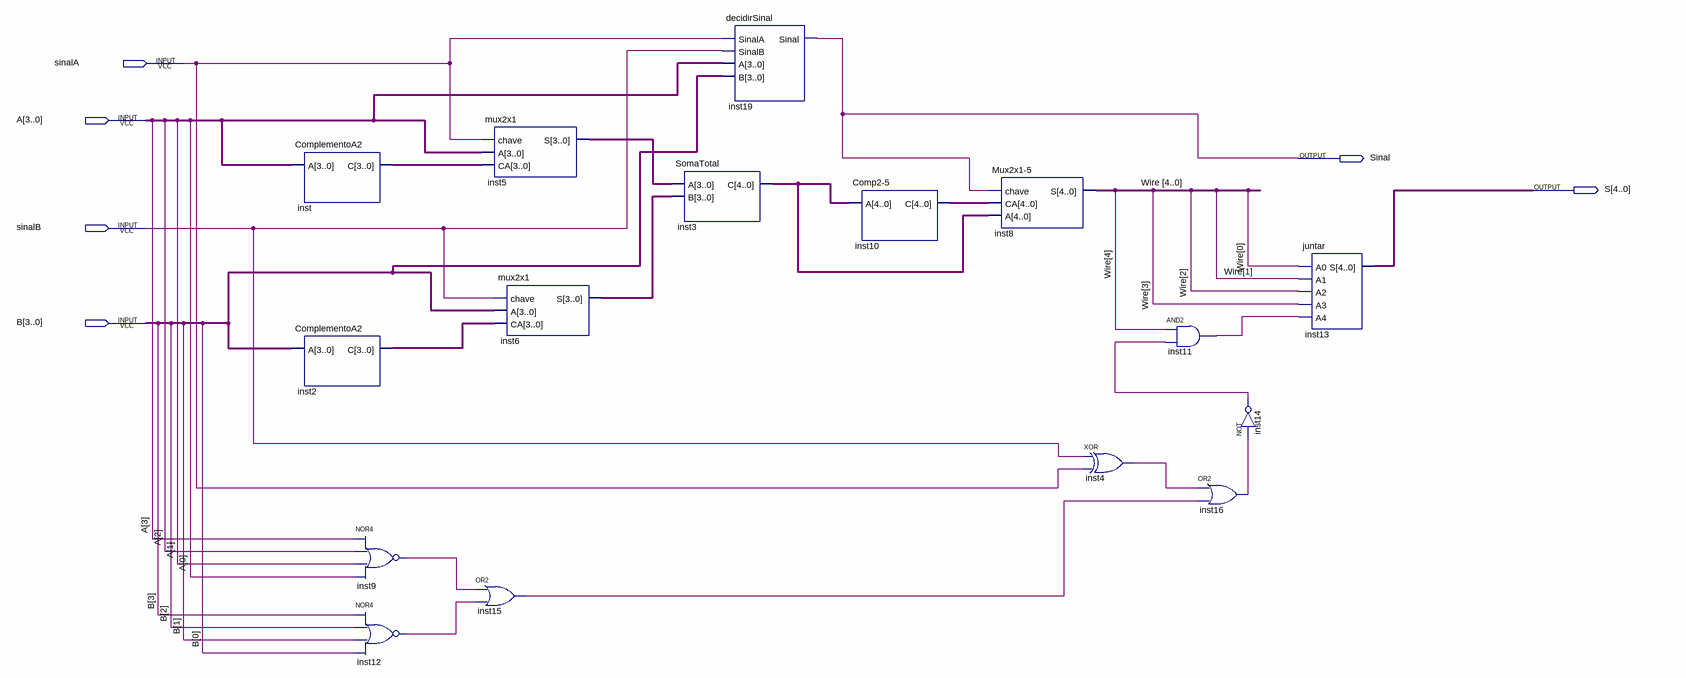
[diagram p0: schematic sheet]
// Quartus schematic somadorSupremo.bdf as structural Verilog: 16 symbols, 6 pins
module somadorSupremo (
  input  sinalA,
  input  [3:0] A,
  input  sinalB,
  input  [3:0] B,
  output Sinal,
  output [4:0] S
);

  wire inst4_out, inst9_out, inst11_out, inst12_out, inst14_out, inst15_out, inst16_out;
  wire [3:0] inst2_c, inst5_s, inst6_s, inst_c;
  wire [4:0] inst3_c, inst10_c, Wire;

  ComplementoA2 inst (.A(A), .C(inst_c));
  ComplementoA2 inst2 (.A(B), .C(inst2_c));
  nor inst9 (inst9_out, A[3], A[2], A[1], A[0]);
  nor inst12 (inst12_out, B[3], B[2], B[1], B[0]);
  mux2x1 inst5 (.chave(sinalA), .A(A), .CA(inst_c), .S(inst5_s));
  or inst15 (inst15_out, inst9_out, inst12_out);
  mux2x1 inst6 (.chave(sinalB), .A(B), .CA(inst2_c), .S(inst6_s));
  SomaTotal inst3 (.A(inst5_s), .B(inst6_s), .C(inst3_c));
  decidirSinal inst19 (.SinalA(sinalA), .SinalB(sinalB), .A(A), .B(B), .Sinal(Sinal));
  \Comp2-5  inst10 (.A(inst3_c), .C(inst10_c));
  \Mux2x1-5  inst8 (.chave(Sinal), .CA(inst10_c), .A(inst3_c), .S(Wire));
  xor inst4 (inst4_out, sinalB, sinalA);
  and inst11 (inst11_out, Wire[4], inst14_out);
  not inst14 (inst14_out, inst16_out);
  or inst16 (inst16_out, inst4_out, inst15_out);
  juntar inst13 (.A0(Wire[0]), .A1(Wire[1]), .A2(Wire[2]), .A3(Wire[3]), .A4(inst11_out), .S(S));
endmodule
